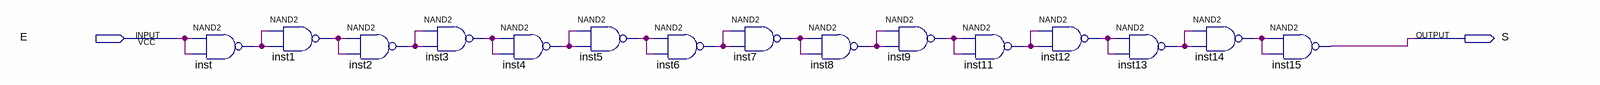
[diagram p0: schematic sheet]
// Quartus schematic BufferRetrasador.bdf as structural Verilog: 15 symbols, 2 pins
module BufferRetrasador (
  input  E,
  output S
);

  wire inst1_out, inst2_out, inst3_out, inst4_out, inst5_out, inst6_out, inst7_out, inst8_out, inst9_out,
       inst11_out, inst12_out, inst13_out, inst14_out, inst_out;

  nand inst (inst_out, E, E);
  nand inst1 (inst1_out, inst_out, inst_out);
  nand inst2 (inst2_out, inst1_out, inst1_out);
  nand inst3 (inst3_out, inst2_out, inst2_out);
  nand inst4 (inst4_out, inst3_out, inst3_out);
  nand inst5 (inst5_out, inst4_out, inst4_out);
  nand inst6 (inst6_out, inst5_out, inst5_out);
  nand inst7 (inst7_out, inst6_out, inst6_out);
  nand inst8 (inst8_out, inst7_out, inst7_out);
  nand inst9 (inst9_out, inst8_out, inst8_out);
  nand inst11 (inst11_out, inst9_out, inst9_out);
  nand inst12 (inst12_out, inst11_out, inst11_out);
  nand inst13 (inst13_out, inst12_out, inst12_out);
  nand inst14 (inst14_out, inst13_out, inst13_out);
  nand inst15 (S, inst14_out, inst14_out);
endmodule
